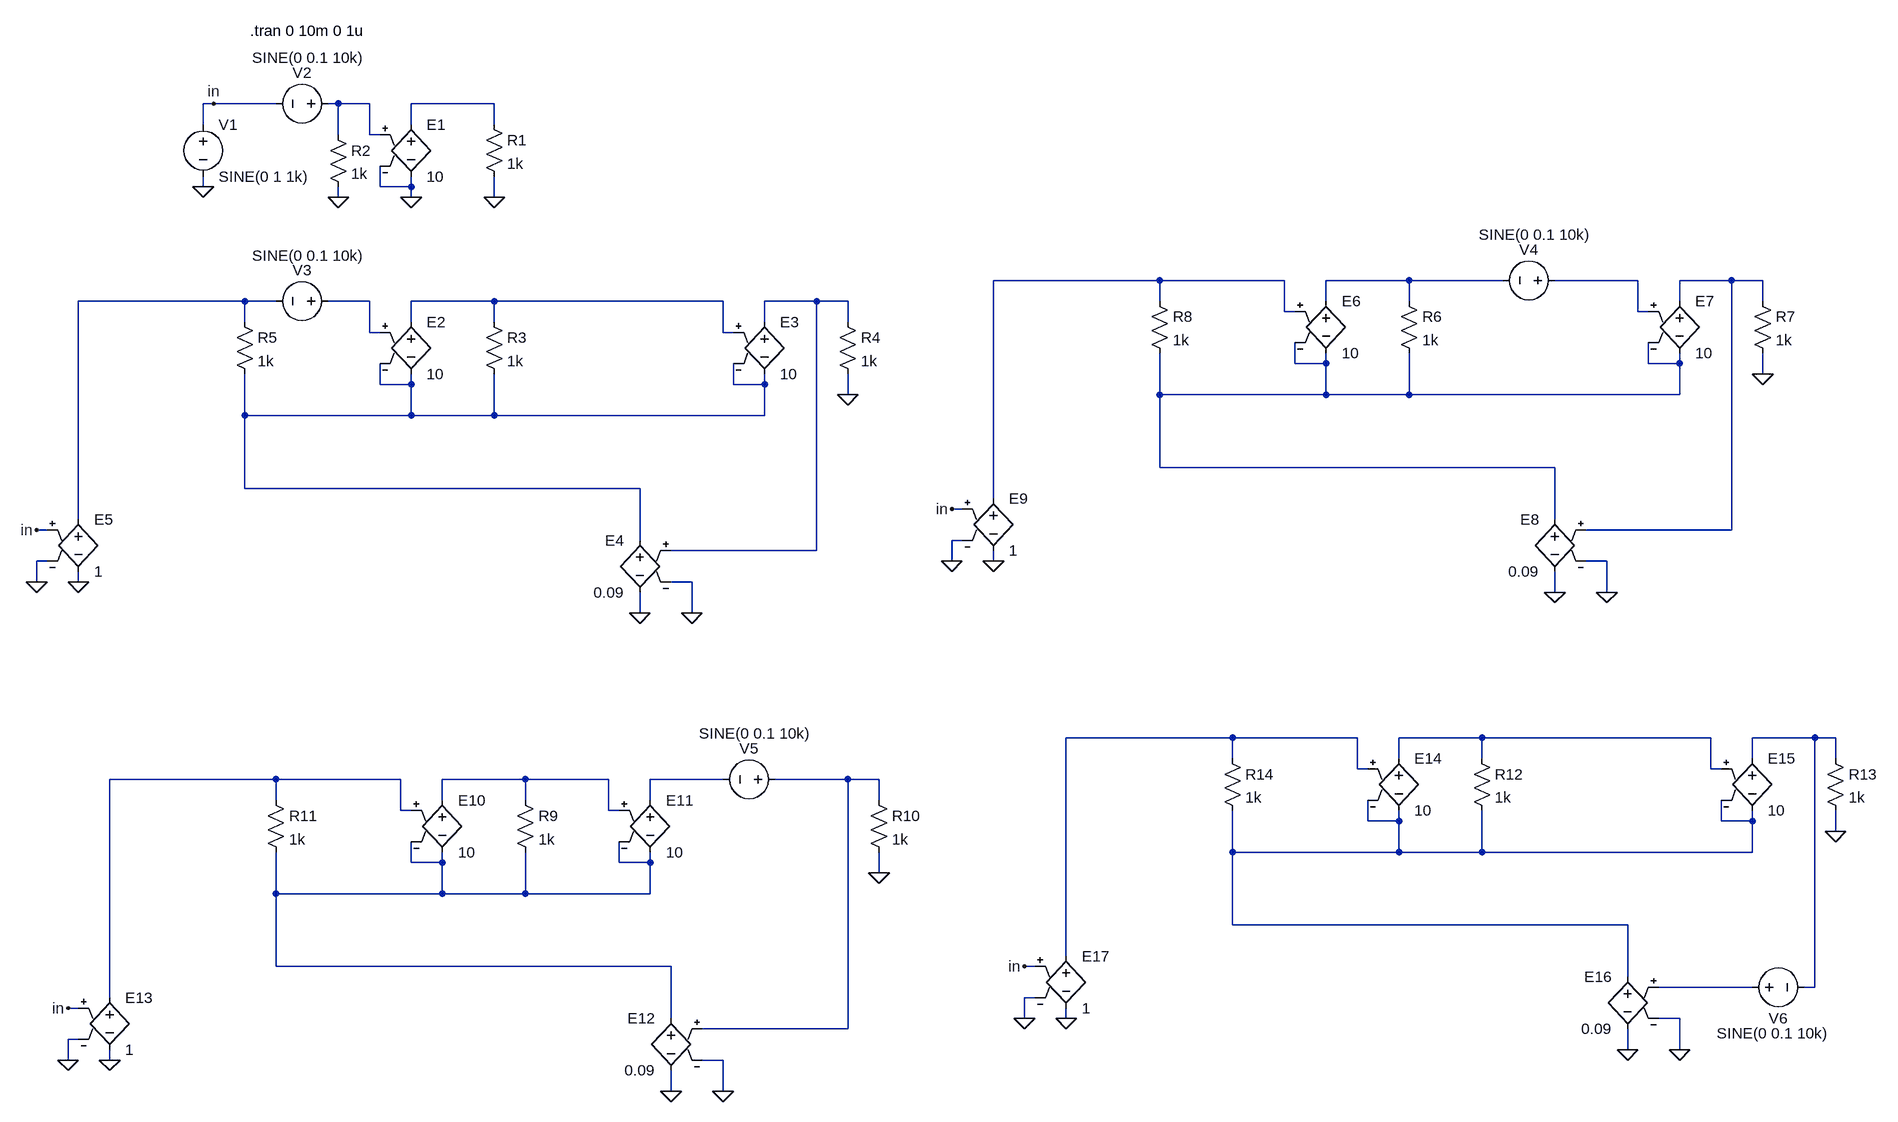
[diagram p0: schematic perturbaciones.asc]
perturbaciones.asc, the LTspice schematic file:
Version 4
SHEET 1 2744 1588
WIRE -64 48 -80 48
WIRE 32 48 -64 48
WIRE 128 48 112 48
WIRE 176 48 128 48
WIRE 368 48 240 48
WIRE -80 80 -80 48
WIRE 240 80 240 48
WIRE 368 80 368 48
WIRE 128 96 128 48
WIRE 176 96 176 48
WIRE 192 96 176 96
WIRE -80 176 -80 160
WIRE 192 176 192 144
WIRE 240 176 240 160
WIRE 240 176 192 176
WIRE 128 192 128 176
WIRE 240 192 240 176
WIRE 368 192 368 160
WIRE 1392 320 1136 320
WIRE 1584 320 1392 320
WIRE 1776 320 1648 320
WIRE 1920 320 1776 320
WIRE 2128 320 2000 320
WIRE 2272 320 2192 320
WIRE 2320 320 2272 320
WIRE -16 352 -272 352
WIRE 32 352 -16 352
WIRE 176 352 112 352
WIRE 368 352 240 352
WIRE 720 352 368 352
WIRE 864 352 784 352
WIRE 912 352 864 352
WIRE 1392 352 1392 320
WIRE 1648 352 1648 320
WIRE 1776 352 1776 320
WIRE 2192 352 2192 320
WIRE 2320 352 2320 320
WIRE 1584 368 1584 320
WIRE 1600 368 1584 368
WIRE 2128 368 2128 320
WIRE 2144 368 2128 368
WIRE -16 384 -16 352
WIRE 240 384 240 352
WIRE 368 384 368 352
WIRE 784 384 784 352
WIRE 912 384 912 352
WIRE 176 400 176 352
WIRE 192 400 176 400
WIRE 720 400 720 352
WIRE 736 400 720 400
WIRE 1600 448 1600 416
WIRE 1648 448 1648 432
WIRE 1648 448 1600 448
WIRE 2144 448 2144 416
WIRE 2192 448 2192 432
WIRE 2192 448 2144 448
WIRE 2320 464 2320 432
WIRE 192 480 192 448
WIRE 240 480 240 464
WIRE 240 480 192 480
WIRE 736 480 736 448
WIRE 784 480 784 464
WIRE 784 480 736 480
WIRE 912 496 912 464
WIRE 1392 496 1392 432
WIRE 1648 496 1648 448
WIRE 1648 496 1392 496
WIRE 1776 496 1776 432
WIRE 1776 496 1648 496
WIRE 2192 496 2192 448
WIRE 2192 496 1776 496
WIRE -16 528 -16 464
WIRE 240 528 240 480
WIRE 240 528 -16 528
WIRE 368 528 368 464
WIRE 368 528 240 528
WIRE 784 528 784 480
WIRE 784 528 368 528
WIRE 1392 608 1392 496
WIRE 2000 608 1392 608
WIRE -16 640 -16 528
WIRE 592 640 -16 640
WIRE 1136 656 1136 320
WIRE 1088 672 1072 672
WIRE -272 688 -272 352
WIRE 2000 688 2000 608
WIRE -320 704 -336 704
WIRE 2272 704 2272 320
WIRE 2272 704 2048 704
WIRE 592 720 592 640
WIRE 1088 720 1072 720
WIRE 864 736 864 352
WIRE 864 736 640 736
WIRE -320 752 -336 752
WIRE 1072 752 1072 720
WIRE 1136 752 1136 736
WIRE 2080 752 2048 752
WIRE -336 784 -336 752
WIRE -272 784 -272 768
WIRE 672 784 640 784
WIRE 2000 800 2000 768
WIRE 2080 800 2080 752
WIRE 592 832 592 800
WIRE 672 832 672 784
WIRE 1504 1024 1248 1024
WIRE 1696 1024 1504 1024
WIRE 1888 1024 1760 1024
WIRE 2240 1024 1888 1024
WIRE 2400 1024 2304 1024
WIRE 2432 1024 2400 1024
WIRE 1504 1056 1504 1024
WIRE 1760 1056 1760 1024
WIRE 1888 1056 1888 1024
WIRE 2304 1056 2304 1024
WIRE 2432 1056 2432 1024
WIRE 1696 1072 1696 1024
WIRE 1712 1072 1696 1072
WIRE 2240 1072 2240 1024
WIRE 2256 1072 2240 1072
WIRE 32 1088 -224 1088
WIRE 224 1088 32 1088
WIRE 416 1088 288 1088
WIRE 544 1088 416 1088
WIRE 720 1088 608 1088
WIRE 912 1088 800 1088
WIRE 960 1088 912 1088
WIRE 32 1120 32 1088
WIRE 288 1120 288 1088
WIRE 416 1120 416 1088
WIRE 608 1120 608 1088
WIRE 960 1120 960 1088
WIRE 224 1136 224 1088
WIRE 240 1136 224 1136
WIRE 544 1136 544 1088
WIRE 560 1136 544 1136
WIRE 1712 1152 1712 1120
WIRE 1760 1152 1760 1136
WIRE 1760 1152 1712 1152
WIRE 2256 1152 2256 1120
WIRE 2304 1152 2304 1136
WIRE 2304 1152 2256 1152
WIRE 2432 1168 2432 1136
WIRE 1504 1200 1504 1136
WIRE 1760 1200 1760 1152
WIRE 1760 1200 1504 1200
WIRE 1888 1200 1888 1136
WIRE 1888 1200 1760 1200
WIRE 2304 1200 2304 1152
WIRE 2304 1200 1888 1200
WIRE 240 1216 240 1184
WIRE 288 1216 288 1200
WIRE 288 1216 240 1216
WIRE 560 1216 560 1184
WIRE 608 1216 608 1200
WIRE 608 1216 560 1216
WIRE 960 1232 960 1200
WIRE 32 1264 32 1200
WIRE 288 1264 288 1216
WIRE 288 1264 32 1264
WIRE 416 1264 416 1200
WIRE 416 1264 288 1264
WIRE 608 1264 608 1216
WIRE 608 1264 416 1264
WIRE 1504 1312 1504 1200
WIRE 2112 1312 1504 1312
WIRE 1248 1360 1248 1024
WIRE 32 1376 32 1264
WIRE 640 1376 32 1376
WIRE 1200 1376 1184 1376
WIRE 2112 1392 2112 1312
WIRE 2304 1408 2160 1408
WIRE 2400 1408 2400 1024
WIRE 2400 1408 2384 1408
WIRE -224 1424 -224 1088
WIRE 1200 1424 1184 1424
WIRE -272 1440 -288 1440
WIRE 640 1456 640 1376
WIRE 1184 1456 1184 1424
WIRE 1248 1456 1248 1440
WIRE 2192 1456 2160 1456
WIRE 912 1472 912 1088
WIRE 912 1472 688 1472
WIRE -272 1488 -288 1488
WIRE 2112 1504 2112 1472
WIRE 2192 1504 2192 1456
WIRE -288 1520 -288 1488
WIRE -224 1520 -224 1504
WIRE 720 1520 688 1520
WIRE 640 1568 640 1536
WIRE 720 1568 720 1520
FLAG 240 192 0
FLAG 368 192 0
FLAG -80 176 0
FLAG 128 192 0
FLAG 912 496 0
FLAG 592 832 0
FLAG 672 832 0
FLAG -64 48 in
FLAG -272 784 0
FLAG -336 784 0
FLAG -336 704 in
FLAG 2320 464 0
FLAG 2000 800 0
FLAG 2080 800 0
FLAG 1136 752 0
FLAG 1072 752 0
FLAG 1072 672 in
FLAG 960 1232 0
FLAG 640 1568 0
FLAG 720 1568 0
FLAG -224 1520 0
FLAG -288 1520 0
FLAG -288 1440 in
FLAG 2432 1168 0
FLAG 2112 1504 0
FLAG 2192 1504 0
FLAG 1248 1456 0
FLAG 1184 1456 0
FLAG 1184 1376 in
SYMBOL e 240 64 R0
SYMATTR InstName E1
SYMATTR Value 10
SYMBOL res 352 64 R0
SYMATTR InstName R1
SYMATTR Value 1k
SYMBOL voltage -80 64 R0
WINDOW 123 0 0 Left 0
WINDOW 39 0 0 Left 0
SYMATTR InstName V1
SYMATTR Value SINE(0 1 1k)
SYMBOL voltage 128 48 R90
WINDOW 0 -32 56 VBottom 2
WINDOW 3 -86 47 VTop 2
WINDOW 123 0 0 Left 0
WINDOW 39 0 0 Left 0
SYMATTR InstName V2
SYMATTR Value SINE(0 0.1 10k)
SYMBOL res 112 80 R0
SYMATTR InstName R2
SYMATTR Value 1k
SYMBOL e 240 368 R0
SYMATTR InstName E2
SYMATTR Value 10
SYMBOL res 352 368 R0
SYMATTR InstName R3
SYMATTR Value 1k
SYMBOL e 784 368 R0
SYMATTR InstName E3
SYMATTR Value 10
SYMBOL res 896 368 R0
SYMATTR InstName R4
SYMATTR Value 1k
SYMBOL e 592 704 M0
SYMATTR InstName E4
SYMATTR Value 0.09
SYMBOL e -272 672 R0
SYMATTR InstName E5
SYMATTR Value 1
SYMBOL voltage 128 352 R90
WINDOW 0 -32 56 VBottom 2
WINDOW 3 -86 47 VTop 2
WINDOW 123 0 0 Left 0
WINDOW 39 0 0 Left 0
SYMATTR InstName V3
SYMATTR Value SINE(0 0.1 10k)
SYMBOL res -32 368 R0
SYMATTR InstName R5
SYMATTR Value 1k
SYMBOL e 1648 336 R0
SYMATTR InstName E6
SYMATTR Value 10
SYMBOL res 1760 336 R0
SYMATTR InstName R6
SYMATTR Value 1k
SYMBOL e 2192 336 R0
SYMATTR InstName E7
SYMATTR Value 10
SYMBOL res 2304 336 R0
SYMATTR InstName R7
SYMATTR Value 1k
SYMBOL e 2000 672 M0
SYMATTR InstName E8
SYMATTR Value 0.09
SYMBOL e 1136 640 R0
SYMATTR InstName E9
SYMATTR Value 1
SYMBOL voltage 2016 320 R90
WINDOW 0 -32 56 VBottom 2
WINDOW 3 -86 47 VTop 2
WINDOW 123 0 0 Left 0
WINDOW 39 0 0 Left 0
SYMATTR InstName V4
SYMATTR Value SINE(0 0.1 10k)
SYMBOL res 1376 336 R0
SYMATTR InstName R8
SYMATTR Value 1k
SYMBOL e 288 1104 R0
SYMATTR InstName E10
SYMATTR Value 10
SYMBOL res 400 1104 R0
SYMATTR InstName R9
SYMATTR Value 1k
SYMBOL e 608 1104 R0
SYMATTR InstName E11
SYMATTR Value 10
SYMBOL res 944 1104 R0
SYMATTR InstName R10
SYMATTR Value 1k
SYMBOL e 640 1440 M0
SYMATTR InstName E12
SYMATTR Value 0.09
SYMBOL e -224 1408 R0
SYMATTR InstName E13
SYMATTR Value 1
SYMBOL voltage 816 1088 R90
WINDOW 0 -32 56 VBottom 2
WINDOW 3 -86 47 VTop 2
WINDOW 123 0 0 Left 0
WINDOW 39 0 0 Left 0
SYMATTR InstName V5
SYMATTR Value SINE(0 0.1 10k)
SYMBOL res 16 1104 R0
SYMATTR InstName R11
SYMATTR Value 1k
SYMBOL e 1760 1040 R0
SYMATTR InstName E14
SYMATTR Value 10
SYMBOL res 1872 1040 R0
SYMATTR InstName R12
SYMATTR Value 1k
SYMBOL e 2304 1040 R0
SYMATTR InstName E15
SYMATTR Value 10
SYMBOL res 2416 1040 R0
SYMATTR InstName R13
SYMATTR Value 1k
SYMBOL e 2112 1376 M0
SYMATTR InstName E16
SYMATTR Value 0.09
SYMBOL e 1248 1344 R0
SYMATTR InstName E17
SYMATTR Value 1
SYMBOL voltage 2288 1408 R270
WINDOW 0 -32 56 VBottom 2
WINDOW 3 -86 47 VTop 2
WINDOW 123 0 0 Left 0
WINDOW 39 0 0 Left 0
SYMATTR InstName V6
SYMATTR Value SINE(0 0.1 10k)
SYMBOL res 1488 1040 R0
SYMATTR InstName R14
SYMATTR Value 1k
TEXT -8 -64 Left 2 !.tran 0 10m 0 1u

The netlist it stands for:
* perturbaciones.asc
E1 N002 0 N001 0 10
R1 N002 0 1k
V1 in 0 SINE(0 1 1k)
V2 N001 in SINE(0 0.1 10k)
R2 N001 0 1k
E2 N009 N012 N008 N012 10
R3 N009 N012 1k
E3 N010 N012 N009 N012 10
R4 N010 0 1k
E4 N012 0 N010 0 0.09
E5 N007 0 in 0 1
V3 N008 N007 SINE(0 0.1 10k)
R5 N007 N012 1k
E6 N004 N011 N003 N011 10
R6 N004 N011 1k
E7 N006 N011 N005 N011 10
R7 N006 0 1k
E8 N011 0 N006 0 0.09
E9 N003 0 in 0 1
V4 N005 N004 SINE(0 0.1 10k)
R8 N003 N011 1k
E10 N017 N021 N016 N021 10
R9 N017 N021 1k
E11 N018 N021 N017 N021 10
R10 N019 0 1k
E12 N021 0 N019 0 0.09
E13 N016 0 in 0 1
V5 N019 N018 SINE(0 0.1 10k)
R11 N016 N021 1k
E14 N014 N020 N013 N020 10
R12 N014 N020 1k
E15 N015 N020 N014 N020 10
R13 N015 0 1k
E16 N020 0 N022 0 0.09
E17 N013 0 in 0 1
V6 N022 N015 SINE(0 0.1 10k)
R14 N013 N020 1k
.tran 0 10m 0 1u
.backanno
.end